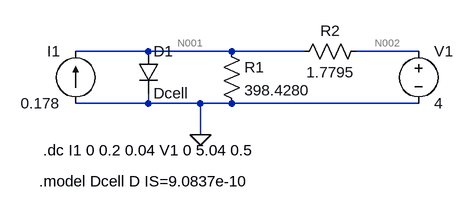
[diagram p0: schematic Main_Test.asc]
Main_Test.asc, the LTspice schematic file:
Version 4
SHEET 1 880 680
WIRE 0 96 -112 96
WIRE 128 96 0 96
WIRE 240 96 128 96
WIRE 416 96 320 96
WIRE 0 176 0 160
WIRE 0 176 -112 176
WIRE 80 176 0 176
WIRE 128 176 80 176
WIRE 416 176 128 176
WIRE 80 224 80 176
FLAG 80 224 0
SYMBOL current -112 176 R180
WINDOW 0 24 80 Left 2
WINDOW 3 24 0 Left 2
WINDOW 123 0 0 Left 0
WINDOW 39 0 0 Left 0
SYMATTR InstName I1
SYMATTR Value 0.178
SYMBOL diode -16 96 R0
SYMATTR InstName D1
SYMATTR Value Dcell
SYMBOL res 112 80 R0
SYMATTR InstName R1
SYMATTR Value 398.4280
SYMBOL res 336 80 R90
WINDOW 0 0 56 VBottom 2
WINDOW 3 32 56 VTop 2
SYMATTR InstName R2
SYMATTR Value 1.7795
SYMBOL voltage 416 80 R0
WINDOW 123 0 0 Left 0
WINDOW 39 0 0 Left 0
SYMATTR InstName V1
SYMATTR Value 4
TEXT -162 248 Left 2 !.dc I1 0 0.2 0.04 V1 0 5.04 0.5
TEXT -168 296 Left 2 !.model Dcell D IS=9.0837e-10

The netlist it stands for:
* Main_Test.asc
I1 0 N001 0.178
D1 N001 0 Dcell
R1 N001 0 398.4280
R2 N002 N001 1.7795
V1 N002 0 4
.model D D
.lib standard.dio
.dc I1 0 0.2 0.04 V1 0 5.04 0.5
.model Dcell D IS=9.0837e-10
.backanno
.end

* Results of the author's LTspice run, read from the files saved beside the schematic
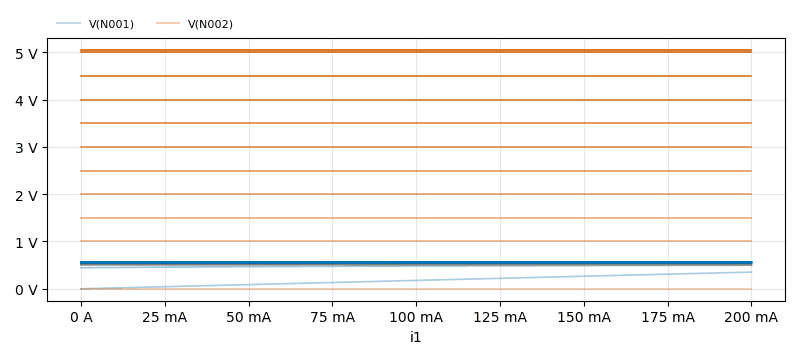
[diagram p1: DC transfer characteristic of Main_Test.asc, plotted from the saved traces]
* DC transfer characteristic, 12 runs:
*   V(N001) [v1=0]: 0 V at i1=0 A, 353 mV at i1=200 mA, min 0 V, max 353 mV
*   V(N001) [v1=0.5]: 446.7 mV at i1=0 A, 496.9 mV at i1=200 mA, min 446.7 mV, max 496.9 mV
*   V(N001) [v1=1]: 505.3 mV at i1=0 A, 518.9 mV at i1=200 mA, min 505.3 mV, max 518.9 mV
*   V(N001) [v1=1.5]: 522.9 mV at i1=0 A, 530.8 mV at i1=200 mA, min 522.9 mV, max 530.8 mV
*   V(N001) [v1=2]: 533.4 mV at i1=0 A, 539 mV at i1=200 mA, min 533.4 mV, max 539 mV
*   V(N001) [v1=2.5]: 540.9 mV at i1=0 A, 545.2 mV at i1=200 mA, min 540.9 mV, max 545.2 mV
*   V(N001) [v1=3]: 546.8 mV at i1=0 A, 550.2 mV at i1=200 mA, min 546.8 mV, max 550.2 mV
*   V(N001) [v1=3.5]: 551.5 mV at i1=0 A, 554.5 mV at i1=200 mA, min 551.5 mV, max 554.5 mV
*   V(N002) [v1=0]: 0 V at i1=0 A, 0 V at i1=200 mA, min 0 V, max 0 V
*   V(N002) [v1=0.5]: 500 mV at i1=0 A, 500 mV at i1=200 mA, min 500 mV, max 500 mV
*   V(N002) [v1=1]: 1 V at i1=0 A, 1 V at i1=200 mA, min 1 V, max 1 V
*   V(N002) [v1=1.5]: 1.5 V at i1=0 A, 1.5 V at i1=200 mA, min 1.5 V, max 1.5 V
*   V(N002) [v1=2]: 2 V at i1=0 A, 2 V at i1=200 mA, min 2 V, max 2 V
*   V(N002) [v1=2.5]: 2.5 V at i1=0 A, 2.5 V at i1=200 mA, min 2.5 V, max 2.5 V
*   V(N002) [v1=3]: 3 V at i1=0 A, 3 V at i1=200 mA, min 3 V, max 3 V
*   V(N002) [v1=3.5]: 3.5 V at i1=0 A, 3.5 V at i1=200 mA, min 3.5 V, max 3.5 V